# Altium schematic sheet Connectors.SchDoc
size A4
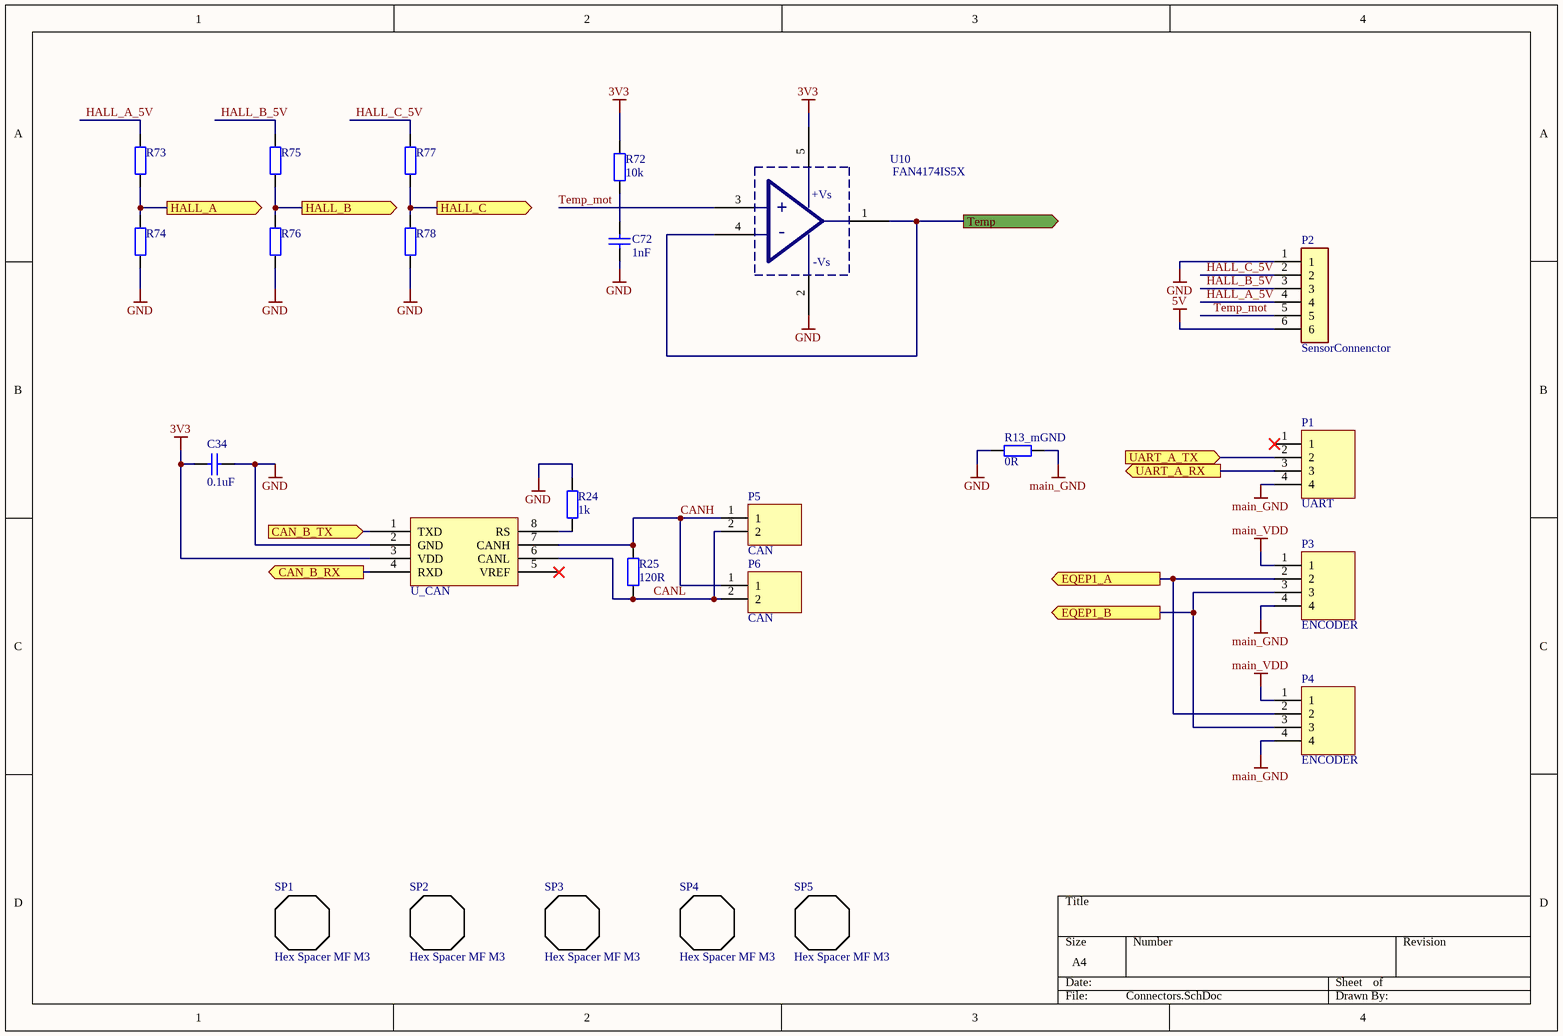
[diagram p0: Connectors.SchDoc]

## Parts
C34  0.1uF  [FP_0603_CAP_080]
C72  1nF  [FP_0603_CAP_080]
P1  UART  [FP_CONN4_TAP_254MM]
P2  SensorConnenctor  [SensorConnector]
P3  ENCODER  [FP_CONN4_TAP_254MM]
P4  ENCODER  [FP_CONN4_TAP_254MM]
P5  CAN  [FP_CONN2_TAP_254MM]
P6  CAN  [FP_CONN2_TAP_254MM]
R13_mGND  0R  [FP_0603_RES]
R24  1k  [FP_0603_RES]
R25  120R  [FP_0805_RES]
R72  10k  [FP_0603_RES]
R73  (no value)  [FP_0603_RES]
R74  (no value)  [FP_0603_RES]
R75  (no value)  [FP_0603_RES]
R76  (no value)  [FP_0603_RES]
R77  (no value)  [FP_0603_RES]
R78  (no value)  [FP_0603_RES]
SP1  Hex Spacer MF M3  [Hex Spacer MF M3 L20mm]
SP2  Hex Spacer MF M3  [Hex Spacer MF M3 L20mm]
SP3  Hex Spacer MF M3  [Hex Spacer MF M3 L20mm]
SP4  Hex Spacer MF M3  [Hex Spacer MF M3 L20mm]
SP5  Hex Spacer MF M3  [Hex Spacer MF M3 L20mm]
U10  FAN4174IS5X  [SOT-23-5]
U_CAN  MCP2551  [SOIC8]  (value not drawn)

## Ports
CAN_B_RX (out), CAN_B_TX (in), EQEP1_A (out), EQEP1_B (out), HALL_A (out), HALL_B (out), HALL_C (out), Temp (out), UART_A_RX (out), UART_A_TX (in)

## Nets
3V3: C34.1 R72.1 U10.5(+Vs) U_CAN.3(VDD)
5V: P2.6
GND: C34.2 C72.1 P2.1 R13_mGND.2 R24.1 R74.2 R76.2 R78.2 U10.2(-Vs) U_CAN.2(GND)
main_GND: P1.4 P3.4 P4.4 R13_mGND.1
main_VDD: P3.1 P4.1
CAN_B_RX: U_CAN.4(RXD) ; port CAN_B_RX
CAN_B_TX: U_CAN.1(TXD) ; port CAN_B_TX
CANH: P5.1 P6.1 R25.1 U_CAN.7(CANH)
CANL: P5.2 P6.2 R25.2 U_CAN.6(CANL)
EQEP1_A: P3.2 P4.2 ; port EQEP1_A
EQEP1_B: P3.3 P4.3 ; port EQEP1_B
HALL_A: R73.2 R74.1 ; port HALL_A
HALL_A_5V: P2.4 R73.1
HALL_B: R75.2 R76.1 ; port HALL_B
HALL_B_5V: P2.3 R75.1
HALL_C: R77.2 R78.1 ; port HALL_C
HALL_C_5V: P2.2 R77.1
Temp: U10.1(OUT) U10.4(-IN) ; port Temp
Temp_mot: P2.5 U10.3(+IN)
UART_A_RX: P1.3 ; port UART_A_RX
UART_A_TX: P1.2 ; port UART_A_TX
NetC72_2: C72.2 R72.2
NetR24_2: R24.2 U_CAN.8(RS)

Not connected (* = marked no-connect by the designer): P1 1*; U_CAN 5(VREF)*

## Notes on the sheet
- (in symbol FAN4174IS5X) +; -

## Library data of the parts
C34 C72 = CAP: Capacitor
  C34: Value: 0.1uF
  C72: Value: 1nF
P1 P3 P4 = Connector_4pin: 4pin Connector
P5 P6 = Connector_2pin: 2pin connector
R13_mGND R24 R25 R72-R78 = RES: Resistor
  R13_mGND: Value: 0R
  R24: Value: 1k
  R25: Value: 120R
  R72: Value: 10k
U10 = FAN4174IS5X: OrderCode: 671-1166; CompType: FAN4174IS5X; Distributor: RS components; Package: SOT-23-5
U_CAN = MCP2551: CAN Driver IC